# Altium schematic sheet Connectors.SchDoc
size A4; SheetNumber: 5; SheetTotal: 5
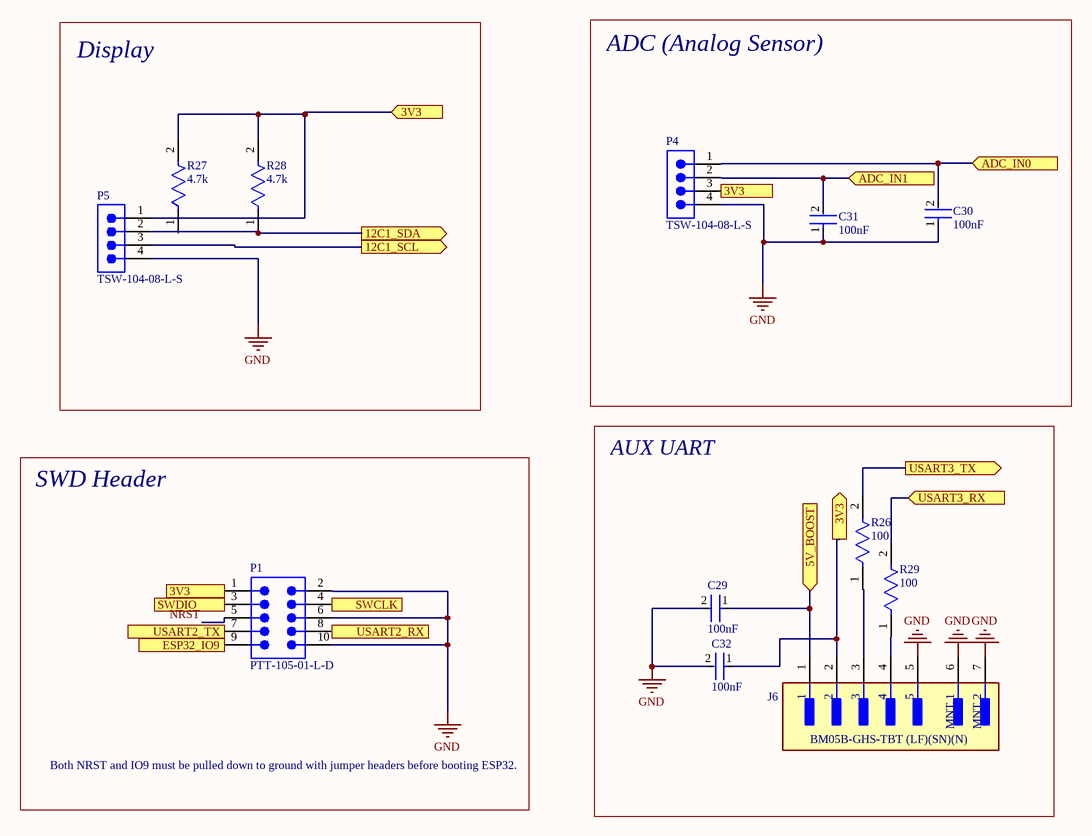
[diagram p0: Connectors.SchDoc]

## Parts
C29  100nF  [FP-C0402-BB-MFG]
C30  100nF  [FP-C0402-BB-MFG]
C31  100nF  [FP-C0402-BB-MFG]
C32  100nF  [FP-C0402-BB-MFG]
J6  BM05B-GHS-TBT (LF)(SN)(N)  [FP-BM05B-GHS-TBT_LF_SN-MFG]
P1  PTT-105-01-L-D  [SMTC-PTT-105-01-X-D]
P4  TSW-104-08-L-S  [SMTC-TSW-104-08-X-S]
P5  TSW-104-08-L-S  [SMTC-TSW-104-08-X-S]
R26  100  [FP-AC0402-MFG]
R27  4.7k  [FP-AC0402-MFG]
R28  4.7k  [FP-AC0402-MFG]
R29  100  [FP-AC0402-MFG]

## Blocks framed on the sheet
Display: P5 R27 R28
ADC (Analog Sensor): C30 C31 P4
SWD Header: P1
AUX UART: C29 C32 J6 R26 R29

## Ports
3V3 (in, see Top_Sheet[2C], MCU,SD,FLASH[3C], MCU,SD,FLASH[4A], MCU,SD,FLASH[4B], MCU,SD,FLASH[5B], MCU,SD,FLASH[5C], MCU,SD,FLASH[6C], MCU,SD,FLASH[7B], Power[3C], RF_Sensors[2B], RF_Sensors[3A]), 3V3 (out, see Top_Sheet[2C], MCU,SD,FLASH[3C], MCU,SD,FLASH[4A], MCU,SD,FLASH[4B], MCU,SD,FLASH[5B], MCU,SD,FLASH[5C], MCU,SD,FLASH[6C], MCU,SD,FLASH[7B], Power[3C], RF_Sensors[2B], RF_Sensors[3A]), 5V_BOOST (in, see Top_Sheet[2C], Power[2D]), 12C1_SCL (out, see Top_Sheet[3C], MCU,SD,FLASH[2B]), 12C1_SDA (out, see Top_Sheet[3C], MCU,SD,FLASH[2B]), ADC_IN0 (in, see Top_Sheet[3C], MCU,SD,FLASH[2A]), ADC_IN1 (in, see Top_Sheet[3C], MCU,SD,FLASH[2A]), ESP32_IO9 (in, see Top_Sheet[3C], RF_Sensors[3C]), SWCLK (in, see Top_Sheet[3C], MCU,SD,FLASH[2B]), SWDIO (in, see Top_Sheet[3C], MCU,SD,FLASH[2B]), USART2_RX (out, see Top_Sheet[3C], MCU,SD,FLASH[2B], RF_Sensors[3B]), USART2_TX (in, see Top_Sheet[3C], MCU,SD,FLASH[2A], RF_Sensors[3B]), USART3_RX (in, see Top_Sheet[3C], MCU,SD,FLASH[2B]), USART3_TX (out, see Top_Sheet[3C], MCU,SD,FLASH[2B])

## Nets
GND: C29.2 C30.1 C31.1 C32.2 J6.5 J6.6(MNT_1) J6.7(MNT_2) P1.2 P1.6 P1.10 P4.4 P5.4
3V3: C32.1 J6.2 P1.1 P4.3 P5.1 R27.2 R28.2 ; port 3V3
5V_BOOST: C29.1 J6.1 ; port 5V_BOOST
12C1_SCL: P5.3 ; port 12C1_SCL
12C1_SDA: P5.2 R28.1 ; port 12C1_SDA
ADC_IN0: C30.2 P4.1 ; port ADC_IN0
ADC_IN1: C31.2 P4.2 ; port ADC_IN1
ESP32_IO9: P1.9 ; port ESP32_IO9
NRST: P1.5
SWCLK: P1.4 ; port SWCLK
SWDIO: P1.3 ; port SWDIO
USART2_RX: P1.8 ; port USART2_RX
USART2_TX: P1.7 ; port USART2_TX
USART3_RX: R29.2 ; port USART3_RX
USART3_TX: R26.2 ; port USART3_TX
NetJ6_3: J6.3 R26.1
NetJ6_4: J6.4 R29.1

Not connected (* = marked no-connect by the designer): R27 1

## Notes on the sheet
- Both NRST and IO9 must be pulled down to ground with jumper headers before booting ESP32.

## Library data of the parts
C29-C32 = CMP-1034-02066-3: CAP CER 0.1UF 10V 20% X7R 0402; Manufacturer Part Number: C0402C104M8RACTU; Manufacturer: Kemet; Tolerance: 0.2; Capacitance: 0.10 μF; Value: 0.10 μF; Material: Ceramic; Temperature Coefficient: 15%; Temperature Range Low: -55°C; Device Class L3: Ceramic Capacitors; RoHS: TRUE; Automotive: No; Device Class L2: Capacitors; Temperature Characteristic: X7R; Octopart: https://octopart.com/c0402c104m8ractu-kemet-9144037; Digikey Description: CAP CER 0.1UF 10V 20% X7R 0402; Mouser Description: Multilayer Ceramic Capacitors MLCC - SMD/SMT 10volts 0.1uF X7R 20%; Ipc Land Pattern Name: CAPC10050X50; Voltage Rating: 10 V; Lead Free: Yes; Device Class L1: Passive Components; ComponentLink2URL: https://content.kemet.com/datasheets/KEM_C1002_X7R_SMD.pdf; Category: Cap; ComponentLink2Description: Datasheet; Temperature Range High: +125°C; Height: 0.55mm; Temperature: -55°C to +125°C; Package: C0402-BB
J6 = CMP-17439-000467-1: CONN HEADER SMD 5POS 1.25MM; Pitch: 0.049inch; Number of Positions: 5; Mated Stacking Heights: 7.3mm; Voltage Rating: 50V; Contact Material: Bronze; Number of Pins: 5; Contact Type: Outer Shroud Contact; Lead Free: Lead Free; Insulation Material: Nylon; Flammability Rating: UL94 V-0; Min Operating Temperature: -25°C; Series: GH; Mount: Surface Mount; Number of Rows: 1; Color: Natural; Packaging: Cut Tape; Contact Shape: Rectangular; Contact Plating: Tin; Contact Finish - Mating: TIN; Connector Type: Header; Insulation Color: Natural; Fastening Type: Ramp; Termination: Solder; Max Operating Temperature: 85°C
P1 = CMP-1029-00144-1: Press Fit Header, Through-hole, Vertical, -55 to 125 degC, 2 mm Pitch, 10-Pin, Male, RoHS; Manufacturer: Samtec; Pitch: 2 mm; ComponentLink3URL: http://www.samtec.com/documents/webfiles/cpdf/PTT-1XX-XX-XX-X-XXX-MKT.pdf; ComponentLink1URL: http://www.samtec.com; ComponentLink2Description: Datasheet; Temperature Range: -55 to 125 degC; Orientation: Vertical; ComponentLink2URL: http://d2a072wq521u33.cloudfront.net/catalog_english//ptt.pdf; Mounting Technology: Through-hole; PackageReference: PTT-105-01-X-D; RoHS: True; ComponentLink3Description: Package Specification; PackageVersion: E, 12/2000; PartNumber: PTT-105-01-L-D; PackageDescription: 2 mm Press Fit Terminal Strip; DatasheetVersion: F-214; ComponentLink1Description: Manufacturer URL
P4 P5 = CMP-1024-00358-1: 0.025" SQ Post Header, Through-hole, Vertical, -55 to 125 degC, 2.54 mm Pitch, 4-Pin, Male, RoHS; Manufacturer: Samtec; Pitch: 2.54 mm; PartNumber: TSW-104-08-L-S; RoHS: True; Temperature Range: -55 to 125 degC; PackageDescription: .025[0.64] SQ. Post Terminal Strip Assembly; Orientation: Vertical; ComponentLink2URL: http://www.samtec.com/documents/webfiles/pdf/TSW_TH.PDF; ComponentLink1Description: Manufacturer URL; ComponentLink2Description: Datasheet; PackageVersion: DM, 8/1988; ComponentLink3URL: http://www.samtec.com/documents/webfiles/cpdf/TSW-XXX-XX-XXX-X-XX-XXX-MKT.pdf; Mounting Technology: Through-hole; PackageReference: TSW-104-08-X-S; ComponentLink3Description: Package Specification; ComponentLink1URL: http://www.samtec.com; DatasheetVersion: F-214
R26 R29 = CMP-03412-022855-2: RES 100Ω ±1% 0.063W 0402; Resistance: 100R; RoHS Compliant: Yes; Tolerance: 1%; Case/Package: 0402
R27 R28 = CMP-03412-009386-2: RES 4.7kΩ ±1% 0.063W 0402